# EAGLE schematic flashcart (EAGLE 7.7.0)
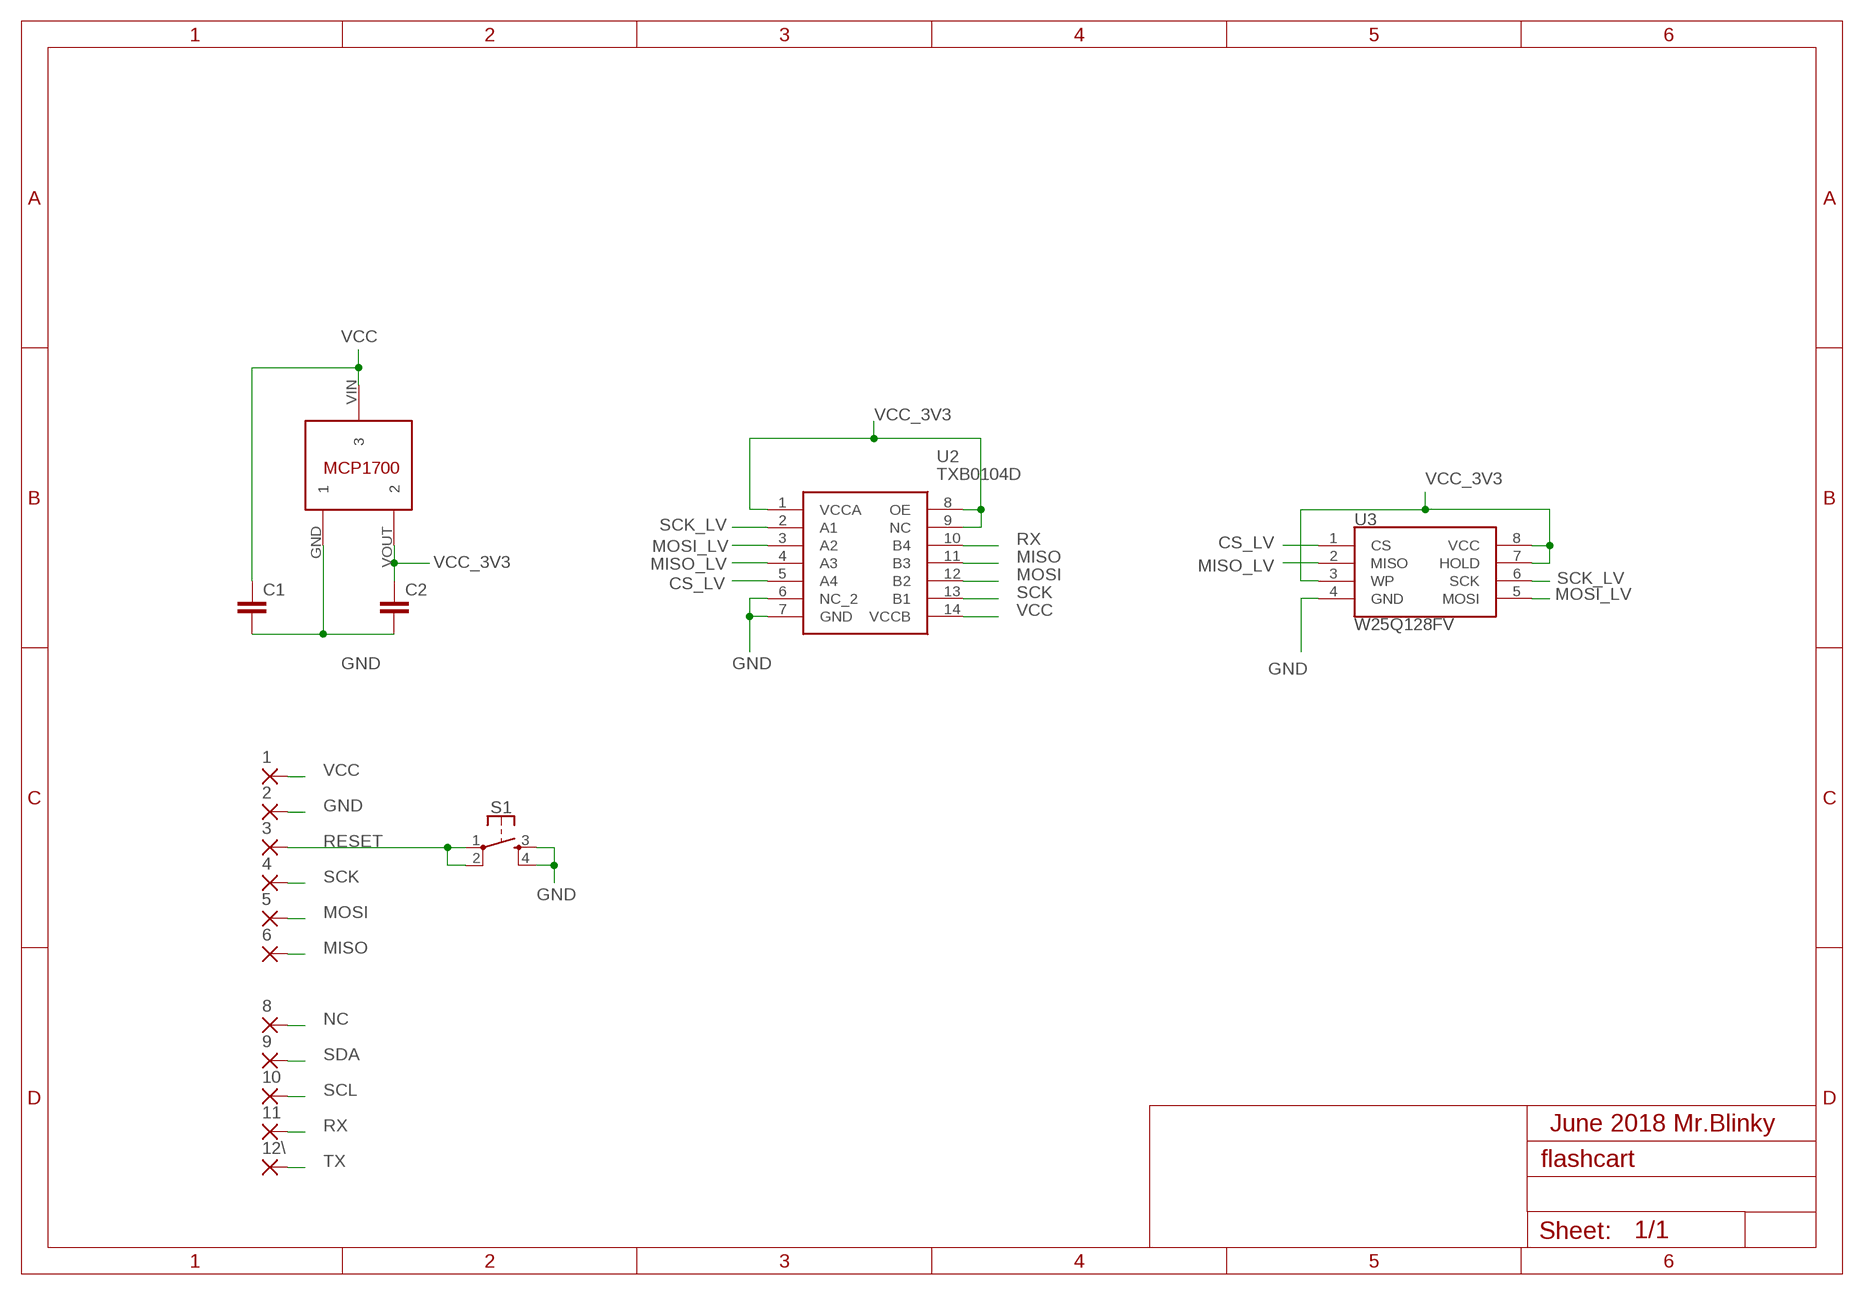
[diagram p0: schematic, sheet 1]

## Parts
1  SMD2  [SMD1,27-2,54]
2  SMD2  [SMD1,27-2,54]
3  SMD2  [SMD1,27-2,54]
4  SMD2  [SMD1,27-2,54]
5  SMD2  [SMD1,27-2,54]
6  SMD2  [SMD1,27-2,54]
8  SMD2  [SMD1,27-2,54]
9  SMD2  [SMD1,27-2,54]
10  SMD2  [SMD1,27-2,54]
11  SMD2  [SMD1,27-2,54]
12\  SMD2  [SMD1,27-2,54]
C1  C-EUC1206  [C1206]
C2  C-EUC1206  [C1206]
S1  MOMENTARY-SWITCH-SPST-2-SMD-5.2MM  [TACTILE_SWITCH_SMD_5.2MM]
U1  MCP1700T-3302E/TT  [MCP1700T-3302E/TT]
U2  TXB0104D  [SOIC127P600X175-14N]
U3  W25Q128FV  SPI_FLASH-X25XXSMD1  [SO08-EIAJ]

## Nets
CS_LV: U2.5(A4) U3.1(CS)
GND: 2.1(P) C1.2 C2.2 S1.3 S1.4 U1.GND U2.6(NC_2) U2.7(GND) U3.4(GND)
MISO: 6.1(P) U2.11(B3)
MISO_LV: U2.4(A3) U3.2(MISO)
MOSI: 5.1(P) U2.12(B2)
MOSI_LV: U2.3(A2) U3.5(MOSI)
NC: 8.1(P)
RESET: 3.1(P) S1.1 S1.2
RX: 11.1(P) U2.10(B4)
SCK: 4.1(P) U2.13(B1)
SCK_LV: U2.2(A1) U3.6(SCK)
SCL: 10.1(P)
SDA: 9.1(P)
TX: 12\.1(P)
VCC: 1.1(P) C1.1 U1.VIN U2.14(VCCB)
VCC_3V3: C2.1 U1.VOUT U2.1(VCCA) U2.8(OE) U2.9(NC) U3.3(WP) U3.7(HOLD) U3.8(VCC)

## Notes on the sheet
- June 2018 Mr.Blinky

## Library data of the parts
1-6 8-11 12\ = wirepad:SMD2: SMD PAD
C1 C2 = rcl:C-EU: CAPACITOR, European symbol; SPICEPREFIX: C
S1 = SparkFun-Switches:MOMENTARY-SWITCH-SPST-2: Momentary Switch (Pushbutton) - SPST - Two Circuits Normally-open (NO) SPST momentary switches (buttons, pushbuttons). Schematic symbol includes two switch circuits. Variants SMD-4.6MMX2.8MM - 4.60mm x 2.80mm Tactile Momentary Button Switch - Used on SparkFun SAMD21 Mini Breakout <https://www.sparkfun.com/products/13664> SMD-5.2MM - Mini Pushbutton Switch - SMD <https://www.sparkfun.com/products/8720> - Used on Arduino Pro Mini <https://www.sparkfun.com/products/11114>; PROD_ID: SWCH-08247; SF_SKU: COM-08720
U1 = MCP1700T-3302E_TT:MCP1700T-3302E/TT: Microchip LDO "MCP1700" in a 3-Pin SOT-23 package. ID: MCP1700T-3302E/TT
U2 = TXB0104D:TXB0104D: 4-BIT BIDIRECTIONAL VOLTAGE-LEVEL TRANSLATOR WITH AUTOMATIC DIRECTION SENSING AND 15-kV ESD PROTECTION Source: Datasheet <http://www.ti.com/lit/gpn/txb0104>; ARROW_PART_NUMBER: TXB0104D; ARROW_PRICE/STOCK: https://www.arrow.com/en/products/txb0104d/texas-instruments; DESCRIPTION: 4-BIT BIDIRECTIONAL VOLTAGE-LEVEL TRANSLATOR WITH AUTOMATIC DIRECTION SENSING AND 15-kV ESD PROTECTION; HEIGHT: mm; MANUFACTURER_NAME: Texas Instruments; MANUFACTURER_PART_NUMBER: TXB0104D; RS_PART_NUMBER: 7092778P; RS_PRICE/STOCK: http://uk.rs-online.com/web/p/products/7092778P
U3 = SparkFun-IC-Memory:SPI_FLASH-X25XX: 32M Serial Flash Memory 8pin SPI Flash series x25xx. Works with devices like W25X32 and BR25L32 Datasheet <http://www.macronix.com/Lists/Datasheet/Attachments/5031/MX25L3206E,%203V,%2032Mb,%20v1.5.pdf> SparkFun Products SparkFun Venus GPS Logger <https://www.sparkfun.com/products/10920> (GPS-10920); PROD_ID: IC-09109; VALUE: 25F32006WSOI